# Altium schematic sheet Sheet.SchDoc
size A4; SheetNumber: 1; SheetTotal: 1
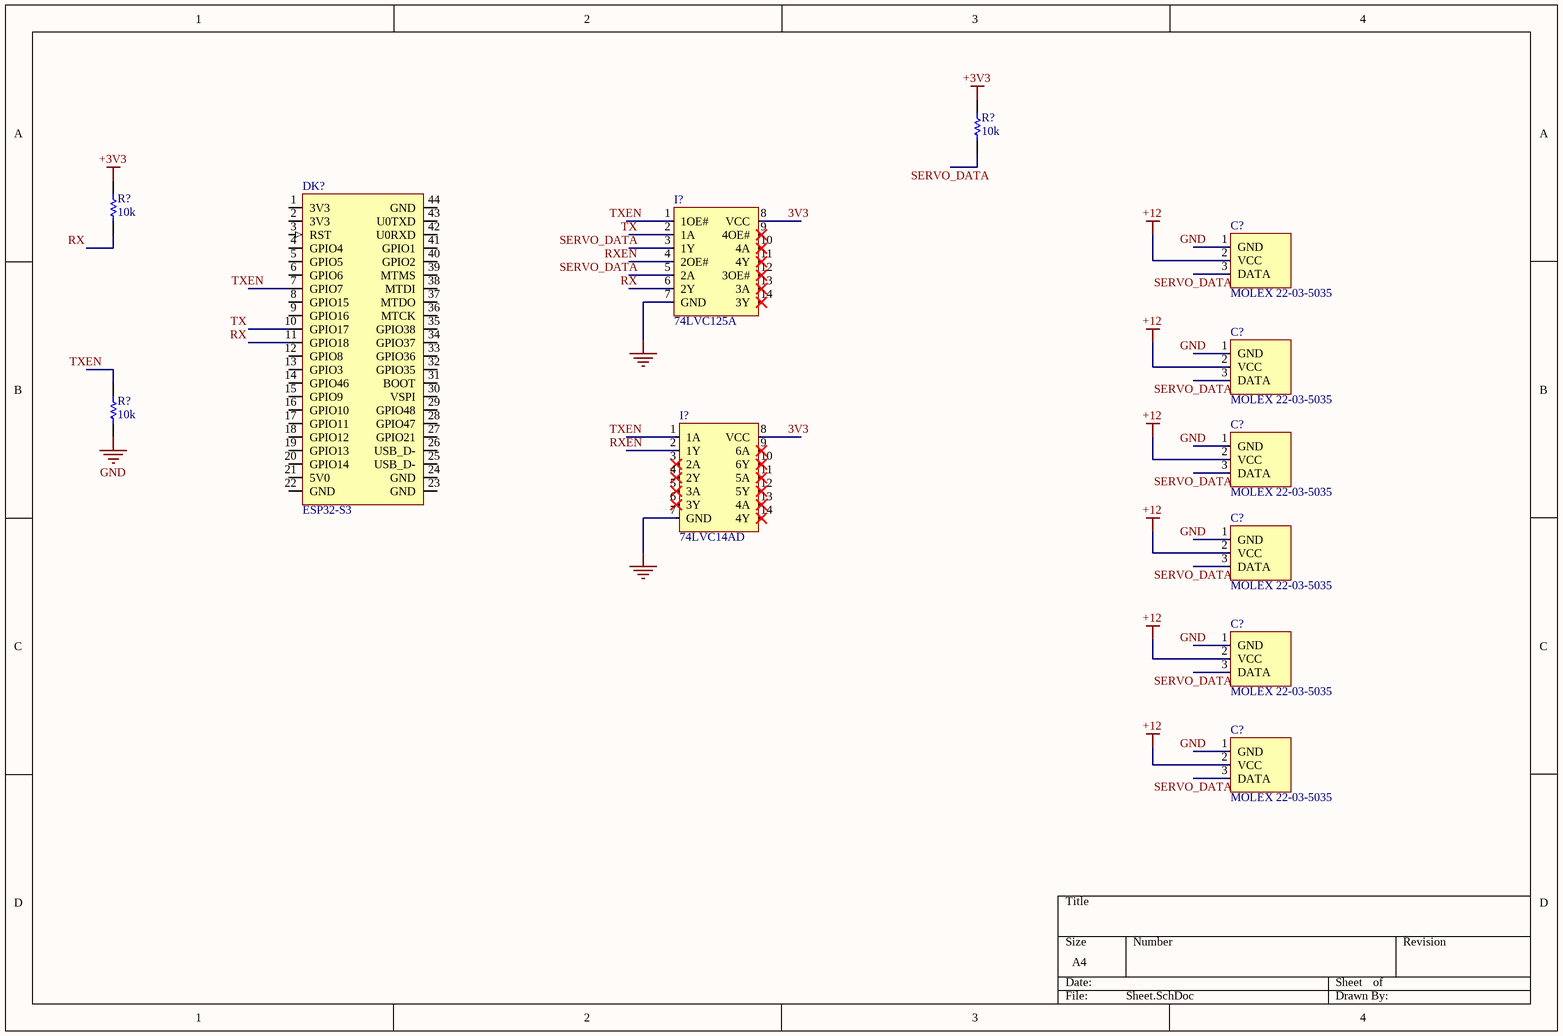
[diagram p0: Sheet.SchDoc]

## Parts
(Parts that share a designator on the sheet are numbered #1, #2 ... from top to bottom, then left to right.)
C?#1  MOLEX 22-03-5035  [PCBComponent_1]
C?#2  MOLEX 22-03-5035  [PCBComponent_1]
C?#3  MOLEX 22-03-5035  [PCBComponent_1]
C?#4  MOLEX 22-03-5035  [PCBComponent_1]
C?#5  MOLEX 22-03-5035  [PCBComponent_1]
C?#6  MOLEX 22-03-5035  [PCBComponent_1]
DK?  ESP32-S3  [ESP32-S3-DevKit footprint]
I?#1  74LVC125A  [SOP14]
I?#2  74LVC14AD  [SOP14]
R?#1  10k  [RESC1609X50X30NL8T20]
R?#2  10k  [RESC1609X50X30NL8T20]
R?#3  10k  [RESC1609X50X30NL8T20]

## Nets
+3V3: R?#1.1 R?#2.2
+12: C?#1.2(VCC) C?#2.2(VCC) C?#3.2(VCC) C?#4.2(VCC) C?#5.2(VCC) C?#6.2(VCC)
GND: C?#1.1(GND) C?#2.1(GND) C?#3.1(GND) C?#4.1(GND) C?#5.1(GND) C?#6.1(GND) I?#1.7(GND) I?#2.7(GND) R?#3.2
3V3: I?#1.8(VCC) I?#2.8(VCC)
RX: DK?.11(GPIO18) I?#1.6(2Y) R?#2.1
RXEN: I?#1.4(2OE#) I?#2.2(1Y)
SERVO_DATA: C?#1.3(DATA) C?#2.3(DATA) C?#3.3(DATA) C?#4.3(DATA) C?#5.3(DATA) C?#6.3(DATA) I?#1.3(1Y) I?#1.5(2A) R?#1.2
TX: DK?.10(GPIO17) I?#1.2(1A)
TXEN: DK?.7(GPIO7) I?#1.1(1OE#) I?#2.1(1A) R?#3.1

Not connected (* = marked no-connect by the designer): DK? 1(3V3) 2(3V3) 3(RST) 4(GPIO4) 5(GPIO5) 6(GPIO6) 8(GPIO15) 9(GPIO16) 12(GPIO8) 13(GPIO3) 14(GPIO46) 15(GPIO9) 16(GPIO10) 17(GPIO11) 18(GPIO12) 19(GPIO13) 20(GPIO14) 21(5V0) 22(GND) 23(GND) 24(GND) 25(USB_D-) 26(USB_D-) 27(GPIO21) 28(GPIO47) 29(GPIO48) 30(VSPI) 31(BOOT) 32(GPIO35) 33(GPIO36) 34(GPIO37) 35(GPIO38) 36(MTCK) 37(MTDO) 38(MTDI) 39(MTMS) 40(GPIO2) 41(GPIO1) 42(U0RXD) 43(U0TXD) 44(GND); I?#1 9(4OE#)* 10(4A)* 11(4Y)* 12(3OE#)* 13(3A)* 14(3Y)*; I?#2 3(2A)* 4(2Y)* 5(3A)* 6(3Y)* 9(6A)* 10(6Y)* 11(5A)* 12(5Y)* 13(4A)* 14(4Y)*

## Library data of the parts
DK? = ESP32-S3-N16R2 DevKit
R?#1-R?#3 = CMP-1666-00005-4: Chip Resistor, 10 KOhm, +/- 1%, 100 mW, -55 to 155 degC, 0603 (1608 Metric), RoHS, Tape and Reel; Manufacturer: Vishay Semiconductor; Voltage Rating: 75 V; Max Operating Temperature: 155 degC; PackageDescription: 2-Pin Surface Mount Device, Body 1.575 x 0.85 mm; ComponentLink1Description: Manufacturer URL; RoHSCompliant: true; PackageReference: 0603; REACH SVHC: Unknown; Length: 1.55 mm; DatasheetVersion: 06/2012; Packaging: Tape and Reel; Min Operating Temperature: -55 degC; Mounting Technology: Surface Mount; ComponentLink2URL: https://datasheet.ciiva.com/11809/0900766b80d98afc-11809037.pdf; Height: 0.45 mm; ComponentLink2Description: Datasheet; Package Quantity: 5000; ComponentLink1URL: http://www.vishay.com/